# EasyEDA schematic 10.1a.json
TITLE: Sheet_1; REV: 1.0; Date: 2022-05-22; Sheet: 1/1; Company: Your Company
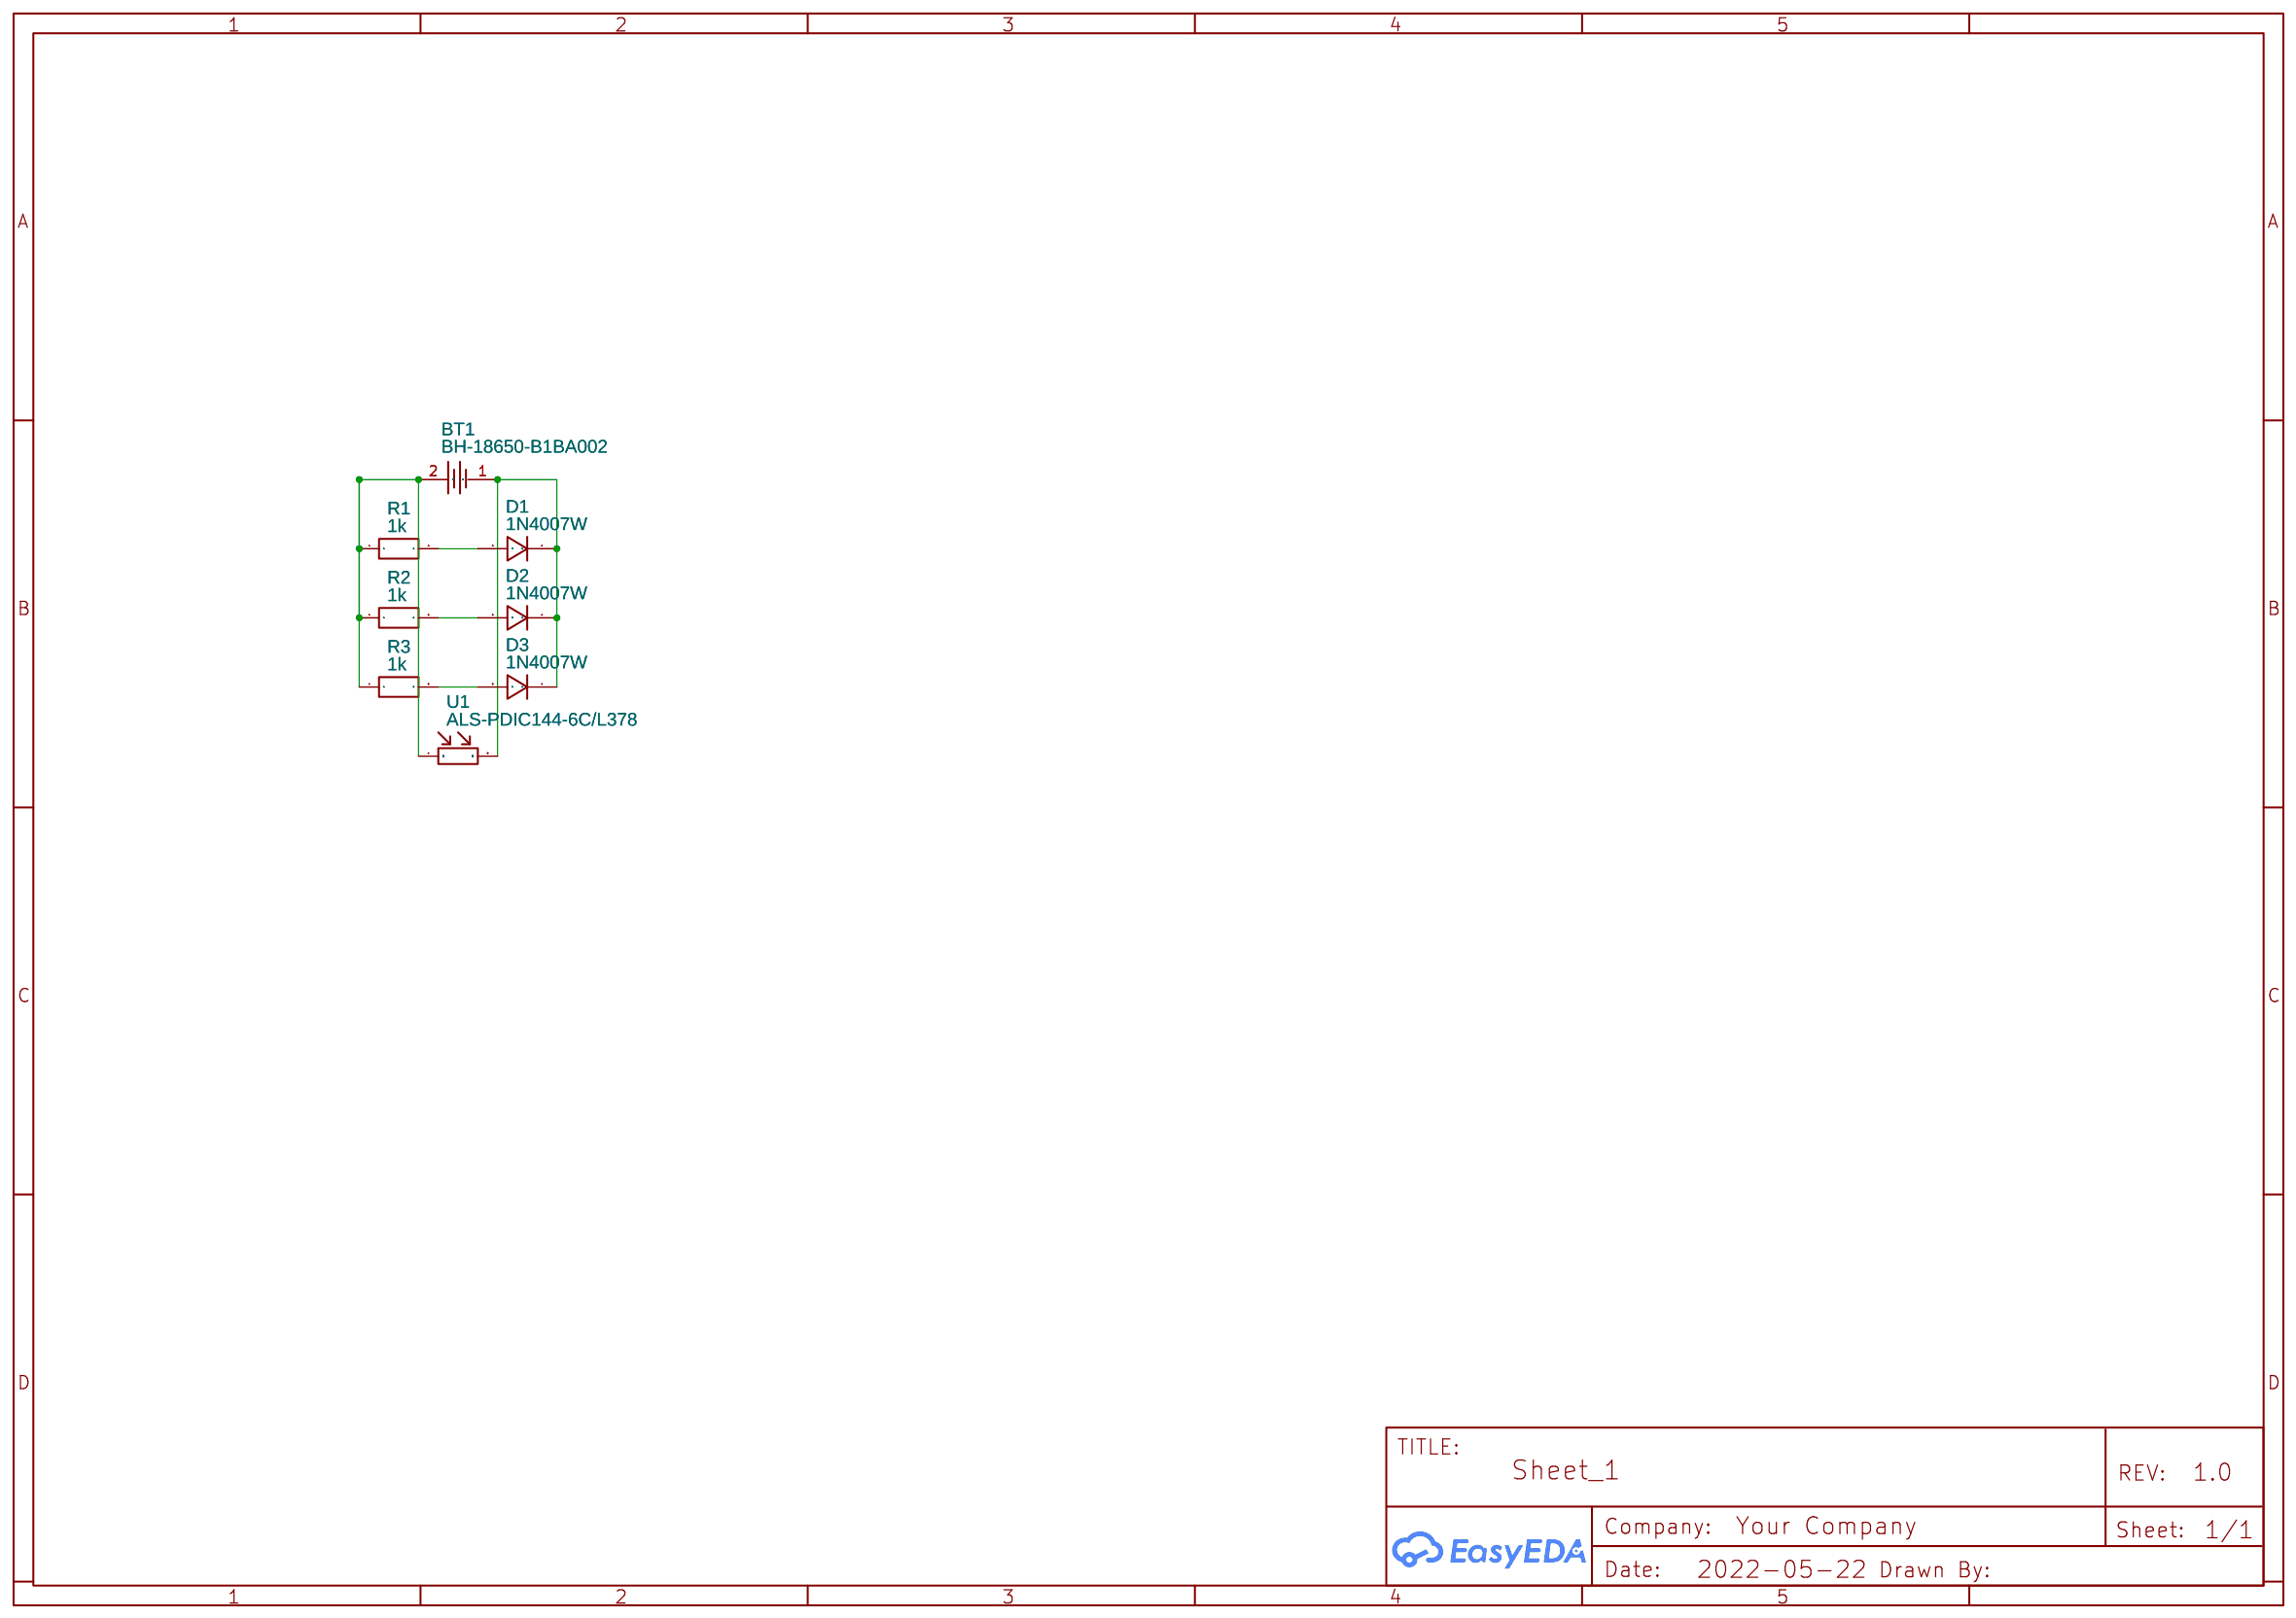
[diagram p0: schematic sheet]

## Parts
BT1  BH-18650-B1BA002  [BATTERY-SMD_18650-1S-L77.1-W20.7-1]
D1  1N4007W  [SOD-123_L2.8-W1.8-LS3.7-RD]
D2  1N4007W  [SOD-123_L2.8-W1.8-LS3.7-RD]
D3  1N4007W  [SOD-123_L2.8-W1.8-LS3.7-RD]
R1  1k  [R0603]
R2  1k  [R0603]
R3  1k  [R0603]
U1  ALS-PDIC144-6C/L378  [SENSORM-TH_EVERLIGHT_ALS-PDIC144-6C--L378]

## Library data of the parts
BT1 = BH-18650-B1BA002: Supplier: LCSC; Supplier Part: C2988620; Manufacturer: MYOUNG(美阳); link: https://atta.szlcsc.com/upload/public/pdf/source/20220402/870DB99AB50CA0DF8D51CF7C86A51FAB.pdf; Contributor: lcsc; JLCPCB Part Class: Extended Part
D1-D3 = 1N4007W: Supplier: LCSC; Supplier Part: C328592; Manufacturer: BLUE ROCKET; Contributor: LCEDA_Lib
R1-R3 = R_0603_EU: Contributor: LCEDA_Lib
U1 = ALS-PDIC144-6C/L378: Supplier: LCSC; Supplier Part: C2943463; Manufacturer: EVERLIGHT(台湾亿光); Contributor: LCSC

## Nets
Net-(BT1-1): BT1.1 D1.1 D2.1 D3.1 U1.2(VOUT)
Net-(BT1-2): BT1.2 R1.1 R2.1 R3.1 U1.1(VCC)
Net-(D1-2): D1.2 R1.2
Net-(D2-2): D2.2 R2.2
Net-(D3-2): D3.2 R3.2
